# Altium project PCB_Project1.PrjPCB
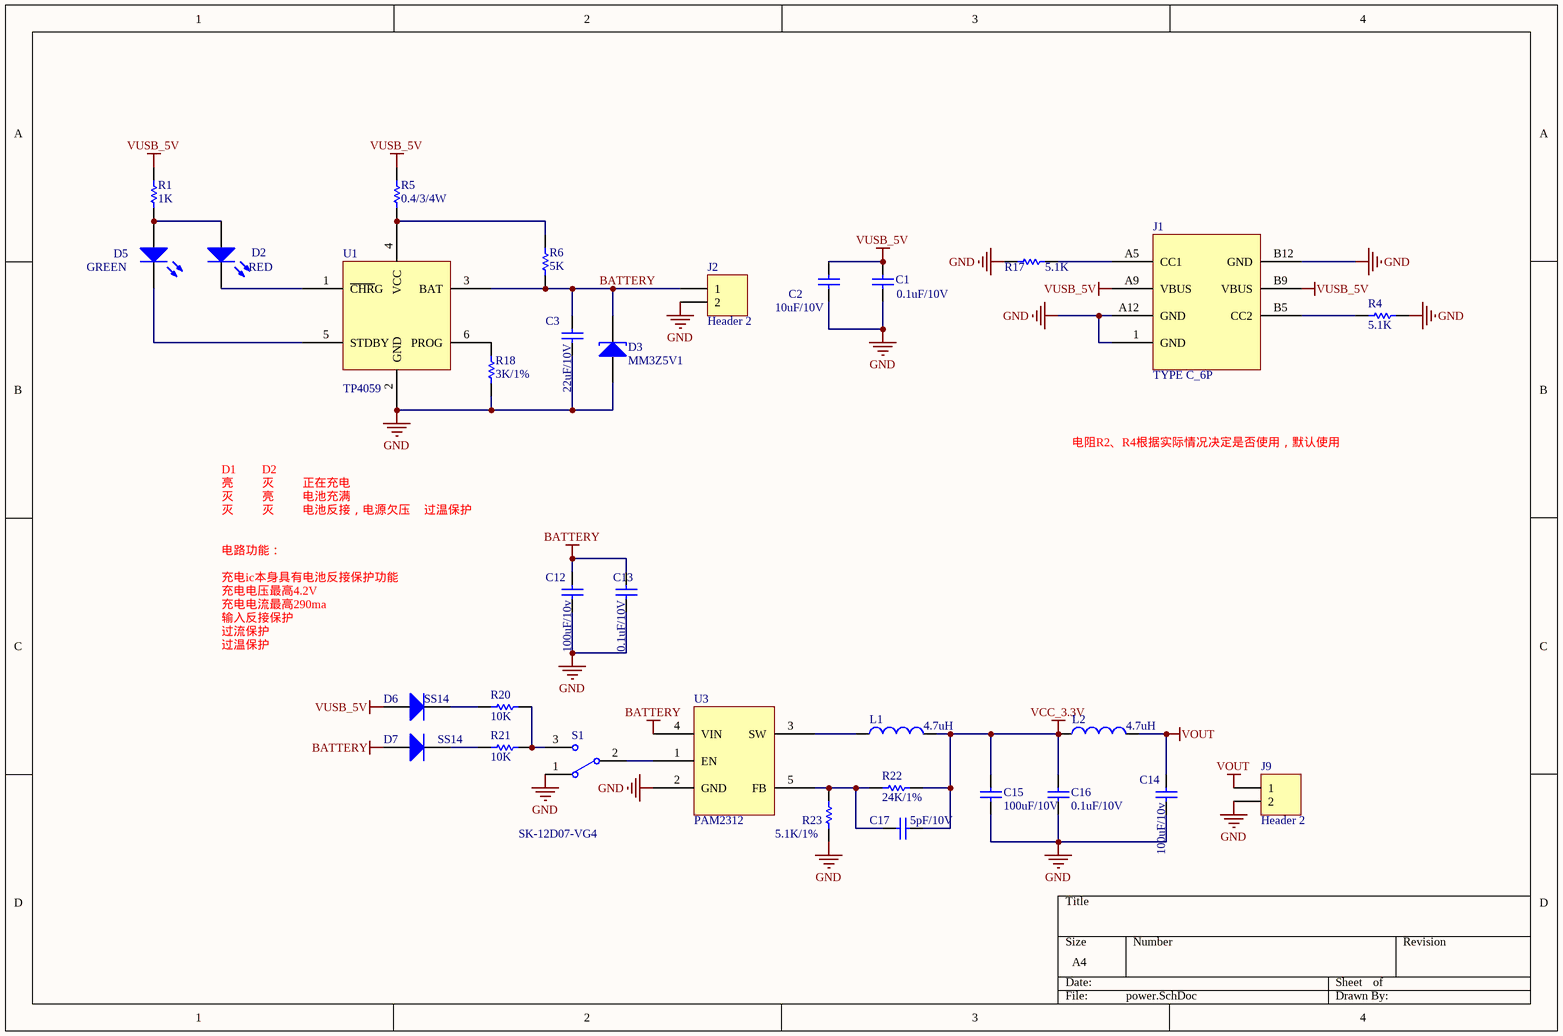
[diagram p0: power.SchDoc]
2 sheets, 60 parts. Net scope: global (net labels, ports and power ports of the same name join across sheets).
Board file: PCB1.PcbDoc
Sheets:
  power.SchDoc
  mcu.SchDoc

## Sheet power.SchDoc
size A4

### Parts
C1  0.1uF/10V  [0402C]
C2  10uF/10V  [0603C]
C3  22uF/10V  [1206C]
C12  100uF/10v  [1206C]
C13  0.1uF/10V  [0402c]
C14  100uF/10v  [1206C]
C15  100uF/10V  [1206C]
C16  0.1uF/10V  [0402C]
C17  5pF/10V  [0402C]
D2  Publisher: RED  [0603LED]
D3  MM3Z5V1  [SOD323]
D5  Publisher: GREEN  [0603LED]
D6  SS14  [SMA]
D7  SS14  [SMA]
J1  TYPE C_6P  [TYPEC_6P]
J2  Header 2  [2X1.25MMZ]
J9  Header 2  [HDR1X2]
L1  4.7uH  [0805r]
L2  4.7uH  [0805r]
R1  1K  [0402R]
R4  5.1K  [0402R]
R5  0.4/3/4W  [2010R]
R6  5K  [0603R]
R17  5.1K  [0402R]
R18  3K/1%  [0402R]
R20  10K  [0402R]
R21  10K  [0402R]
R22  24K/1%  [0402R]
R23  5.1K/1%  [0402R]
S1  SK-12D07-VG4  [SK-12D07-VG4]
U1  TP4059  [sot-23-6]
U3  PAM2312  [SOT-23-5]

### Nets
BATTERY: C3.1 C12.1 C13.1 D3.2(K) D7.1(A) J2.1 R6.1 U1.3(BAT) U3.4(VIN)
GND: C1.1 C2.1 C3.2 C12.2 C13.2 C14.2 C15.1 C16.1 D3.1(A) J1.1(GND) J1.A12(GND) J1.B12(GND) J2.2 J9.2 R4.2 R17.2 R18.1 R23.1 S1.1 U1.2(GND) U3.2(GND)
VCC_3.3V: C15.2 C16.2 C17.2 L1.2 L2.1 R22.2
VOUT: C14.1 J9.1 L2.2
VUSB_5V: C1.2 C2.2 D6.1(A) J1.A9(VBUS) J1.B9(VBUS) R1.2 R5.1
NetC17_1: C17.1 R22.1 R23.2 U3.5(FB)
NetD2_1: D2.1(A) D5.1(A) R1.1
NetD2_2: D2.2(K) U1.1(~{CHR}G)
NetD5_2: D5.2(K) U1.5(STDBY)
NetD6_2: D6.2(K) R20.1
NetD7_2: D7.2(K) R21.1
NetJ1_A5: J1.A5(CC1) R17.1
NetJ1_B5: J1.B5(CC2) R4.1
NetL1_1: L1.1 U3.3(SW)
NetR5_2: R5.2 R6.2 U1.4(VCC)
NetR18_2: R18.2 U1.6(PROG)
NetR20_2: R20.2 R21.2 S1.3
NetS1_2: S1.2 U3.1(EN)

### Notes on the sheet
- 电阻R2、R4根据实际情况决定是否使用，默认使用
- D1
- 亮
- 灭
- D2
- 正在充电
- 电池充满
- 电池反接，电源欠压
- 过温保护
- 充电ic本身具有电池反接保护功能
- 电路功能：
- 输入反接保护
- 充电电流最高290ma
- 充电电压最高4.2V
- 过流保护

### Library data of the parts
C1-C3 C12-C17 = Cap: Capacitor; Value: 100pF; Published: 8-Jun-2000; LatestRevisionDate: 17-Jul-2002; LatestRevisionNote: Re-released for DXP Platform.; PackageReference: RAD-0.3; Publisher: Altium Limited
D2 D5 = LED0: Typical INFRARED GaAs LED; Published: 8-Jun-2000; LatestRevisionDate: 08-Jul-2005; LatestRevisionNote: Mech Layer 1 removed.; PackageReference: LED-0
D3 = D Tunnel1: Tunnel Diode - RLC Model; Published: 8-Jun-2000; LatestRevisionDate: 17-Jul-2002; LatestRevisionNote: Re-released for DXP Platform.; PackageVersion: Feb-2002; PackageReference: 3.2X1.6X1.1; Publisher: Altium Limited
D6 D7 = Diode: Default Diode; Published: 8-Jun-2000; LatestRevisionDate: 17-Jul-2002; LatestRevisionNote: Re-released for DXP Platform.; PackageVersion: Sep-1996; PackageReference: SMC; Publisher: Altium Limited; Code_JEDEC: DO-214-AB
J2 J9 = Header 2: Header, 2-Pin; LatestRevisionDate: 17-Jul-2002; LatestRevisionNote: Re-released for DXP Platform.; Publisher: Altium Limited
L1 L2 = Inductor: Code_IEC: 1005; Value: 10mH; Published: 8-Jun-2000; LatestRevisionDate: 29-May-2009; LatestRevisionNote: IPC-7351 Footprint Added.; PackageReference: 0402-A; Publisher: Altium Limited; PackageDescription: Chip Inductor; Code_JEITA: 0402
R1 = Res Semi: Semiconductor Resistor; Published: 8-Jun-2000; LatestRevisionDate: 17-Jul-2002; LatestRevisionNote: Re-released for DXP Platform.; PackageReference: AXIAL-0.5; Publisher: Altium Limited; Value: 1K
R4-R6 R17 R18 R20-R23 = Res Semi: Semiconductor Resistor; Value: 1K; Published: 8-Jun-2000; LatestRevisionDate: 17-Jul-2002; LatestRevisionNote: Re-released for DXP Platform.; PackageReference: AXIAL-0.5; Publisher: Altium Limited
S1 = SW-SPDT: SPDT Subminiature Toggle Switch, Right Angle Mounting, Vertical Actuation; Published: 24-Mar-1999; LatestRevisionDate: 17-Dec-2003; LatestRevisionNote: Schematic revised, PCB Footprint replaced.; DatasheetVersion: 05-Dec-2000; PackageReference: TL36WW15050; Publisher: Altium Limited; ComponentLink1Description: Manufacturer Link; ComponentLink1URL: http://www.apem.com

## Sheet mcu.SchDoc
size A3
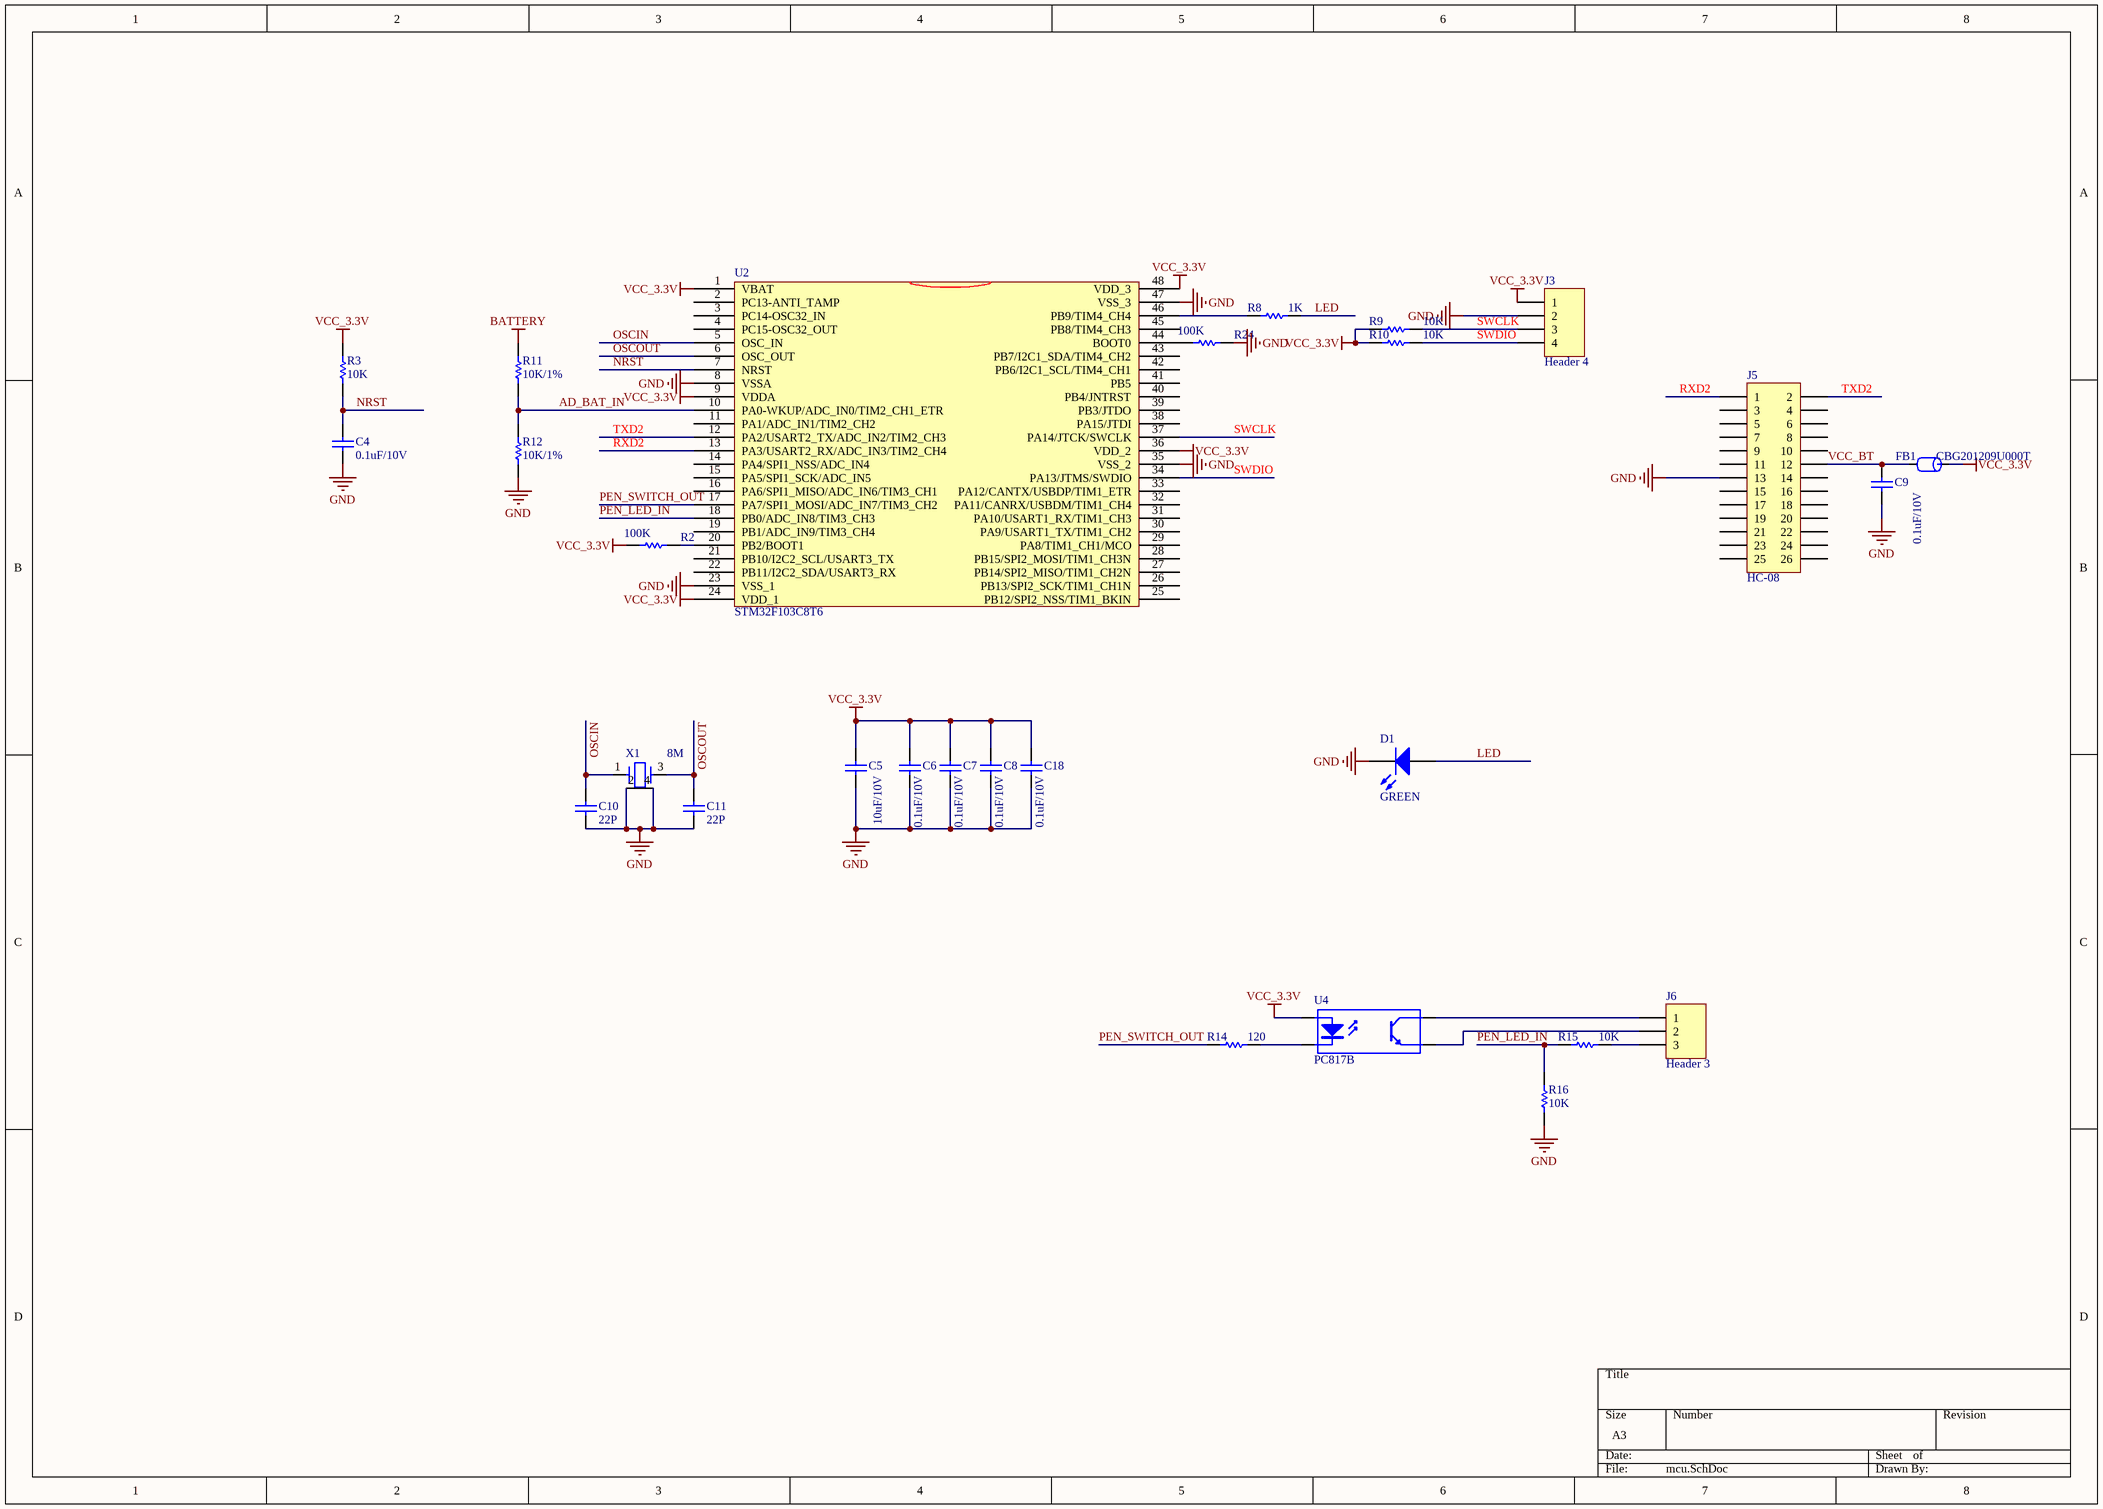
[diagram p1: mcu.SchDoc]

### Parts
C4  0.1uF/10V  [0402C]
C5  10uF/10V  [0603C]
C6  0.1uF/10V  [0402C]
C7  0.1uF/10V  [0402C]
C8  0.1uF/10V  [0402C]
C9  0.1uF/10V  [0402C]
C10  22P  [0402C]
C11  22P  [0402C]
C18  0.1uF/10V  [0402C]
D1  Publisher: GREEN  [0603LED]
FB1  CBG201209U000T  [0805CZ]
J3  Header 4  [mHDR1X4]
J5  HC-08  [HC-08V20/22/41]
J6  Header 3  [HDR1X3]
R2  100K  [0402R]
R3  10K  [0402R]
R8  1K  [0402R]
R9  10K  [0402R]
R10  10K  [0402R]
R11  10K/1%  [0402R]
R12  10K/1%  [0402R]
R14  120  [0402R]
R15  10K  [0402R]
R16  10K  [0402R]
R24  100K  [0402R]
U2  STM32F103C8T6  [TQFP-48]
U4  PC817B  [DIP-4]
X1  8M  [XTAL4TN_3225]

### Nets
BATTERY: R11.1
GND: C4.1 C5.1 C6.1 C7.1 C8.1 C9.1 C10.1 C11.1 C18.1 D1.2(K) J3.2 J5.13 R12.2 R16.1 R24.1 U2.8(VSSA) U2.23(VSS_1) U2.35(VSS_2) U2.47(VSS_3) X1.2(GND) X1.4(GND)
VCC_3.3V: C5.2 C6.2 C7.2 C8.2 C18.2 FB1.1 J3.1 R2.2 R3.1 R9.1 R10.1 U2.1(VBAT) U2.9(VDDA) U2.24(VDD_1) U2.36(VDD_2) U2.48(VDD_3) U4.1(A)
AD_BAT_IN: R11.2 R12.1 U2.10(PA0-WKUP/ADC_IN0/TIM2_CH1_ETR)
LED: D1.1(A) R8.2
NRST: C4.2 R3.2 U2.7(NRST)
OSCIN: C10.2 U2.5(OSC_IN) X1.1(X1)
OSCOUT: C11.2 U2.6(OSC_OUT) X1.3(X2)
PEN_LED_IN: R15.1 R16.2 U2.18(PB0/ADC_IN8/TIM3_CH3)
PEN_SWITCH_OUT: R14.1 U2.17(PA7/SPI1_MOSI/ADC_IN7/TIM3_CH2)
RXD2: J5.1 U2.13(PA3/USART2_RX/ADC_IN3/TIM2_CH4)
SWCLK: J3.3 R9.2 U2.37(PA14/JTCK/SWCLK)
SWDIO: J3.4 R10.2 U2.34(PA13/JTMS/SWDIO)
TXD2: J5.2 U2.12(PA2/USART2_TX/ADC_IN2/TIM2_CH3)
VCC_BT: C9.2 FB1.2 J5.12
NetJ6_1: J6.1 U4.4(C)
NetJ6_2: J6.2 U4.3(E)
NetJ6_3: J6.3 R15.2
NetR2_1: R2.1 U2.20(PB2/BOOT1)
NetR8_1: R8.1 U2.46(PB9/TIM4_CH4)
NetR14_2: R14.2 U4.2(K)
NetR24_2: R24.2 U2.44(BOOT0)

Not connected (* = marked no-connect by the designer): J5 3 4 5 6 7 8 9 10 11 14 15 16 17 18 19 20 21 22 23 24 25 26; U2 2(PC13-ANTI_TAMP) 3(PC14-OSC32_IN) 4(PC15-OSC32_OUT) 11(PA1/ADC_IN1/TIM2_CH2) 14(PA4/SPI1_NSS/ADC_IN4) 15(PA5/SPI1_SCK/ADC_IN5) 16(PA6/SPI1_MISO/ADC_IN6/TIM3_CH1) 19(PB1/ADC_IN9/TIM3_CH4) 21(PB10/I2C2_SCL/USART3_TX) 22(PB11/I2C2_SDA/USART3_RX) 25(PB12/SPI2_NSS/TIM1_BKIN) 26(PB13/SPI2_SCK/TIM1_CH1N) 27(PB14/SPI2_MISO/TIM1_CH2N) 28(PB15/SPI2_MOSI/TIM1_CH3N) 29(PA8/TIM1_CH1/MCO) 30(PA9/USART1_TX/TIM1_CH2) 31(PA10/USART1_RX/TIM1_CH3) 32(PA11/CANRX/USBDM/TIM1_CH4) 33(PA12/CANTX/USBDP/TIM1_ETR) 38(PA15/JTDI) 39(PB3/JTDO) 40(PB4/JNTRST) 41(PB5) 42(PB6/I2C1_SCL/TIM4_CH1) 43(PB7/I2C1_SDA/TIM4_CH2) 45(PB8/TIM4_CH3)

### Library data of the parts
C4-C11 C18 = Cap: Capacitor; Value: 100pF; Published: 8-Jun-2000; LatestRevisionDate: 17-Jul-2002; LatestRevisionNote: Re-released for DXP Platform.; PackageReference: RAD-0.3; Publisher: Altium Limited
D1 = LED0: Typical INFRARED GaAs LED; Published: 8-Jun-2000; LatestRevisionDate: 08-Jul-2005; LatestRevisionNote: Mech Layer 1 removed.; PackageReference: LED-0
FB1 = FB: BLM21PG331SN1D; Text Field1: FB; FB: *
J3 = Header 4: Header, 4-Pin; LatestRevisionDate: 17-Jul-2002; LatestRevisionNote: Re-released for DXP Platform.; Publisher: Altium Limited
J5 = Header 13X2: Header, 13-Pin, Dual row; LatestRevisionDate: 17-Jul-2002; LatestRevisionNote: Re-released for DXP Platform.; Publisher: Altium Limited
J6 = Header 3: Header, 3-Pin; LatestRevisionDate: 17-Jul-2002; LatestRevisionNote: Re-released for DXP Platform.; Publisher: Altium Limited
R2 R24 = Res1: Resistor; Published: 8-Jun-2000; LatestRevisionDate: 17-Jul-2002; LatestRevisionNote: Re-released for DXP Platform.; PackageReference: AXIAL-0.3; Publisher: Altium Limited; Value: 100K
R3 R9-R12 R14-R16 = Res Semi: Semiconductor Resistor; Value: 1K; Published: 8-Jun-2000; LatestRevisionDate: 17-Jul-2002; LatestRevisionNote: Re-released for DXP Platform.; PackageReference: AXIAL-0.5; Publisher: Altium Limited
R8 = Res Semi: Semiconductor Resistor; Published: 8-Jun-2000; LatestRevisionDate: 17-Jul-2002; LatestRevisionNote: Re-released for DXP Platform.; PackageReference: AXIAL-0.5; Publisher: Altium Limited; Value: 1K
U2 = STM32F103C6
U4 = Optoisolator1: 4-Pin Phototransistor Optocoupler; Published: 24-Mar-1999; LatestRevisionDate: 04-Mar-2005; LatestRevisionNote: Sch pins 3 & 4 Swapped.; DatasheetVersion: Nov-2003; PackageReference: DIP-4; Publisher: Altium Limited
X1 = CRYSTAL-4

## Nets that join several sheets
BATTERY: power (9 pins), mcu (R11.1)
GND: power (21 pins), mcu (21 pins)
VCC_3.3V: power (6 pins), mcu (17 pins)